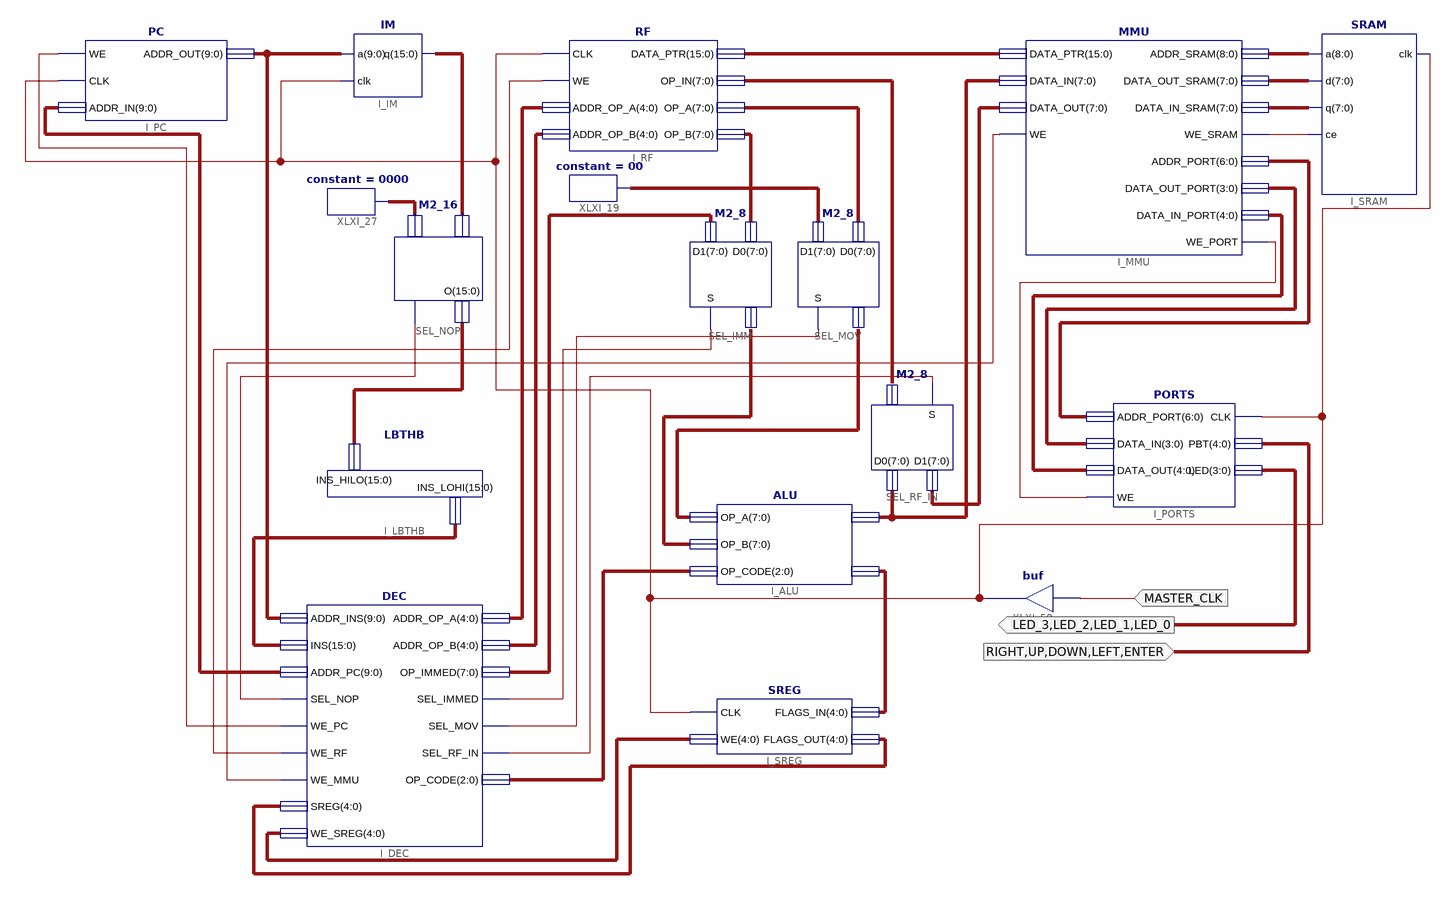
[diagram p0: schematic sheet 1]
// Xilinx ISE schematic RISC_PROCESSOR.sch (virtex4) as structural Verilog: 17 symbols, 3 ports
module RISC_PROCESSOR (
  input  MASTER_CLK,
  input  RIGHT,
  input  UP,
  input  DOWN,
  input  LEFT,
  input  ENTER,
  output LED_3,
  output LED_2,
  output LED_1,
  output LED_0
);

  wire XLXN_49, XLXN_159, XLXN_160, XLXN_167, XLXN_168, XLXN_169, XLXN_253, XLXN_256, XLXN_378, XLXN_391;
  wire [2:0] XLXN_170;
  wire [3:0] XLXN_380;
  wire [4:0] XLXN_39, XLXN_161, XLXN_162, XLXN_278, XLXN_375, XLXN_381;
  wire [6:0] XLXN_379;
  wire [7:0] XLXN_46, XLXN_47, XLXN_53, XLXN_63, XLXN_64, XLXN_79, XLXN_83, XLXN_84, XLXN_96, XLXN_114,
       XLXN_115;
  wire [8:0] XLXN_45;
  wire [9:0] XLXN_185, XLXN_283;
  wire [15:0] XLXN_31, XLXN_247, XLXN_269, XLXN_285, XLXN_430;

  PORTS I_PORTS (
    .ADDR_PORT(XLXN_379), .DATA_IN(XLXN_380), .DATA_OUT(XLXN_381), .WE(XLXN_391),
    .PBT({RIGHT, UP, DOWN, LEFT, ENTER}), .LED({LED_3, LED_2, LED_1, LED_0}), .CLK(XLXN_378));
  constant #(.CValue("0000")) XLXI_27 (.O(XLXN_247));
  SREG I_SREG (.CLK(XLXN_378), .WE(XLXN_278), .FLAGS_OUT(XLXN_375), .FLAGS_IN(XLXN_39));
  PC I_PC (.WE(XLXN_159), .CLK(XLXN_378), .ADDR_IN(XLXN_185), .ADDR_OUT(XLXN_283));
  LBTHB I_LBTHB (.INS_LOHI(XLXN_285), .INS_HILO(XLXN_269));
  constant #(.CValue("00")) XLXI_19 (.O(XLXN_53));
  RF I_RF (
    .ADDR_OP_A(XLXN_161), .ADDR_OP_B(XLXN_162), .OP_IN(XLXN_84), .OP_A(XLXN_64), .OP_B(XLXN_63),
    .DATA_PTR(XLXN_31), .WE(XLXN_160), .CLK(XLXN_378));
  M2_8 SEL_IMM (.D0(XLXN_63), .D1(XLXN_96), .O(XLXN_114), .S(XLXN_167));
  M2_8 SEL_MOV (.D0(XLXN_64), .D1(XLXN_53), .O(XLXN_115), .S(XLXN_168));
  ALU I_ALU (.OP_A(XLXN_115), .OP_B(XLXN_114), .OP_CODE(XLXN_170), .OP_R(XLXN_79), .FLAGS(XLXN_39));
  M2_8 SEL_RF_IN (.D0(XLXN_79), .D1(XLXN_83), .O(XLXN_84), .S(XLXN_169));
  MMU I_MMU (
    .WE(XLXN_256), .DATA_PTR(XLXN_31), .DATA_IN(XLXN_79), .DATA_IN_SRAM(XLXN_47), .DATA_IN_PORT(XLXN_381),
    .WE_SRAM(XLXN_49), .WE_PORT(XLXN_391), .ADDR_SRAM(XLXN_45), .ADDR_PORT(XLXN_379), .DATA_OUT(XLXN_83),
    .DATA_OUT_SRAM(XLXN_46), .DATA_OUT_PORT(XLXN_380));
  DEC I_DEC (
    .WE_PC(XLXN_159), .WE_RF(XLXN_160), .WE_MMU(XLXN_256), .SEL_IMMED(XLXN_167), .SEL_MOV(XLXN_168),
    .SEL_RF_IN(XLXN_169), .ADDR_PC(XLXN_185), .ADDR_OP_A(XLXN_161), .ADDR_OP_B(XLXN_162), .OP_CODE(XLXN_170),
    .OP_IMMED(XLXN_96), .SEL_NOP(XLXN_253), .SREG(XLXN_375), .WE_SREG(XLXN_278), .INS(XLXN_285),
    .ADDR_INS(XLXN_283));
  M2_16 SEL_NOP (.D0(XLXN_430), .D1(XLXN_247), .O(XLXN_269), .S(XLXN_253));
  buf XLXI_59 (XLXN_378, MASTER_CLK);
  IM I_IM (.q(XLXN_430), .a(XLXN_283), .clk(XLXN_378));
  SRAM I_SRAM (.ce(XLXN_49), .a(XLXN_45), .d(XLXN_46), .q(XLXN_47), .clk(XLXN_378));
endmodule
